# EAGLE design Soap (EAGLE 7.1.0)

## Sheet 1 of 2
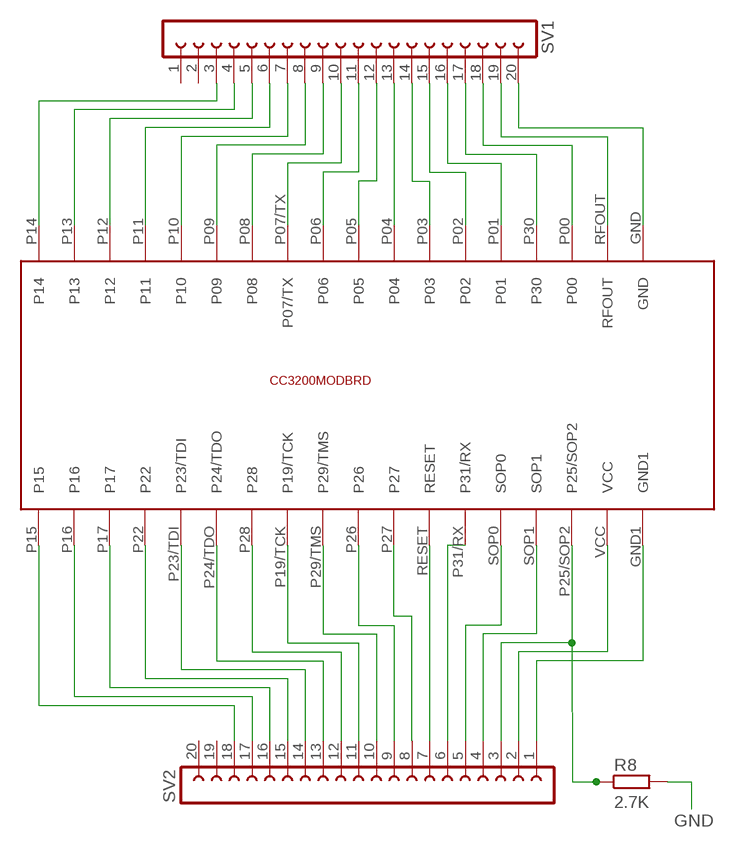
[diagram p0: schematic, sheet 1]

### Parts
R8  2.7K  RESISTOR  [R0603]
SV1  FE20-1  [FE20]
SV2  FE20-1  [FE20]
U$1  CC3200MOD  [CC3200MOD]

### Nets
+3V3: SV2.2 U$1.VCC
GND [vcc]: R8.2 SV1.20 SV2.1 U$1.GND U$1.GND1 ; also sheet 2
N$4: SV2.18 U$1.P15
N$6: SV2.17 U$1.P16
N$7: SV2.16 U$1.P17
N$8: SV2.15 U$1.P22
N$9: SV2.14 U$1.P23/TDI
N$10: SV2.13 U$1.P24/TDO
N$11: SV2.12 U$1.P28
N$12: SV2.11 U$1.P19/TCK
N$13: SV2.10
N$14: SV1.3 U$1.P14
N$15: SV1.4 U$1.P13
N$16: SV1.5 U$1.P12
N$17: SV1.6 U$1.P11
N$18: SV1.7 U$1.P10
N$19: SV1.8 U$1.P09
N$20: SV1.9 U$1.P08
N$21: SV1.10 U$1.P07/TX
N$22: SV1.11 U$1.P06
N$23: SV1.12 U$1.P05
N$24: SV1.13 U$1.P04
N$25: SV1.14 U$1.P03
N$26: SV1.15 U$1.P02
N$27: SV1.16 U$1.P01
N$28: SV1.17 U$1.P30
N$29: SV1.18 U$1.P00
N$30: SV1.19 U$1.RFOUT
N$32: SV2.9 U$1.P26
N$33: SV2.8 U$1.P27
N$34: SV2.7 U$1.RESET
N$35: SV2.6 U$1.P31/RX
N$36: SV2.5 U$1.SOP0
N$37: SV2.4 U$1.SOP1
SOP2: R8.1 SV2.3 U$1.P25/SOP2
Unconnected: SV1.1 SV1.2 SV2.19 SV2.20 U$1.P29/TMS

## Sheet 2 of 2
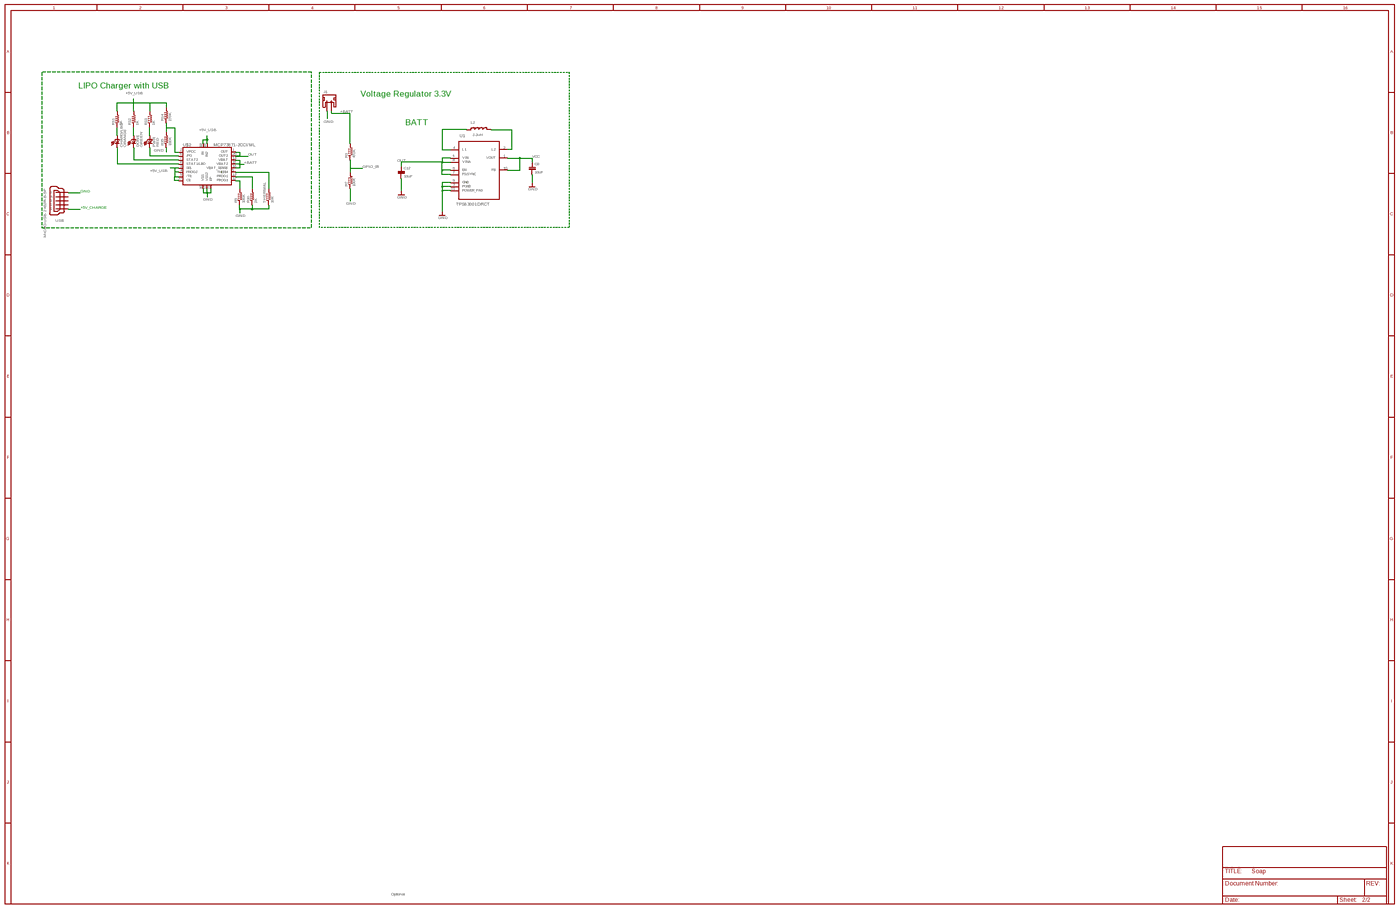
[diagram p1: schematic, sheet 2, overview]
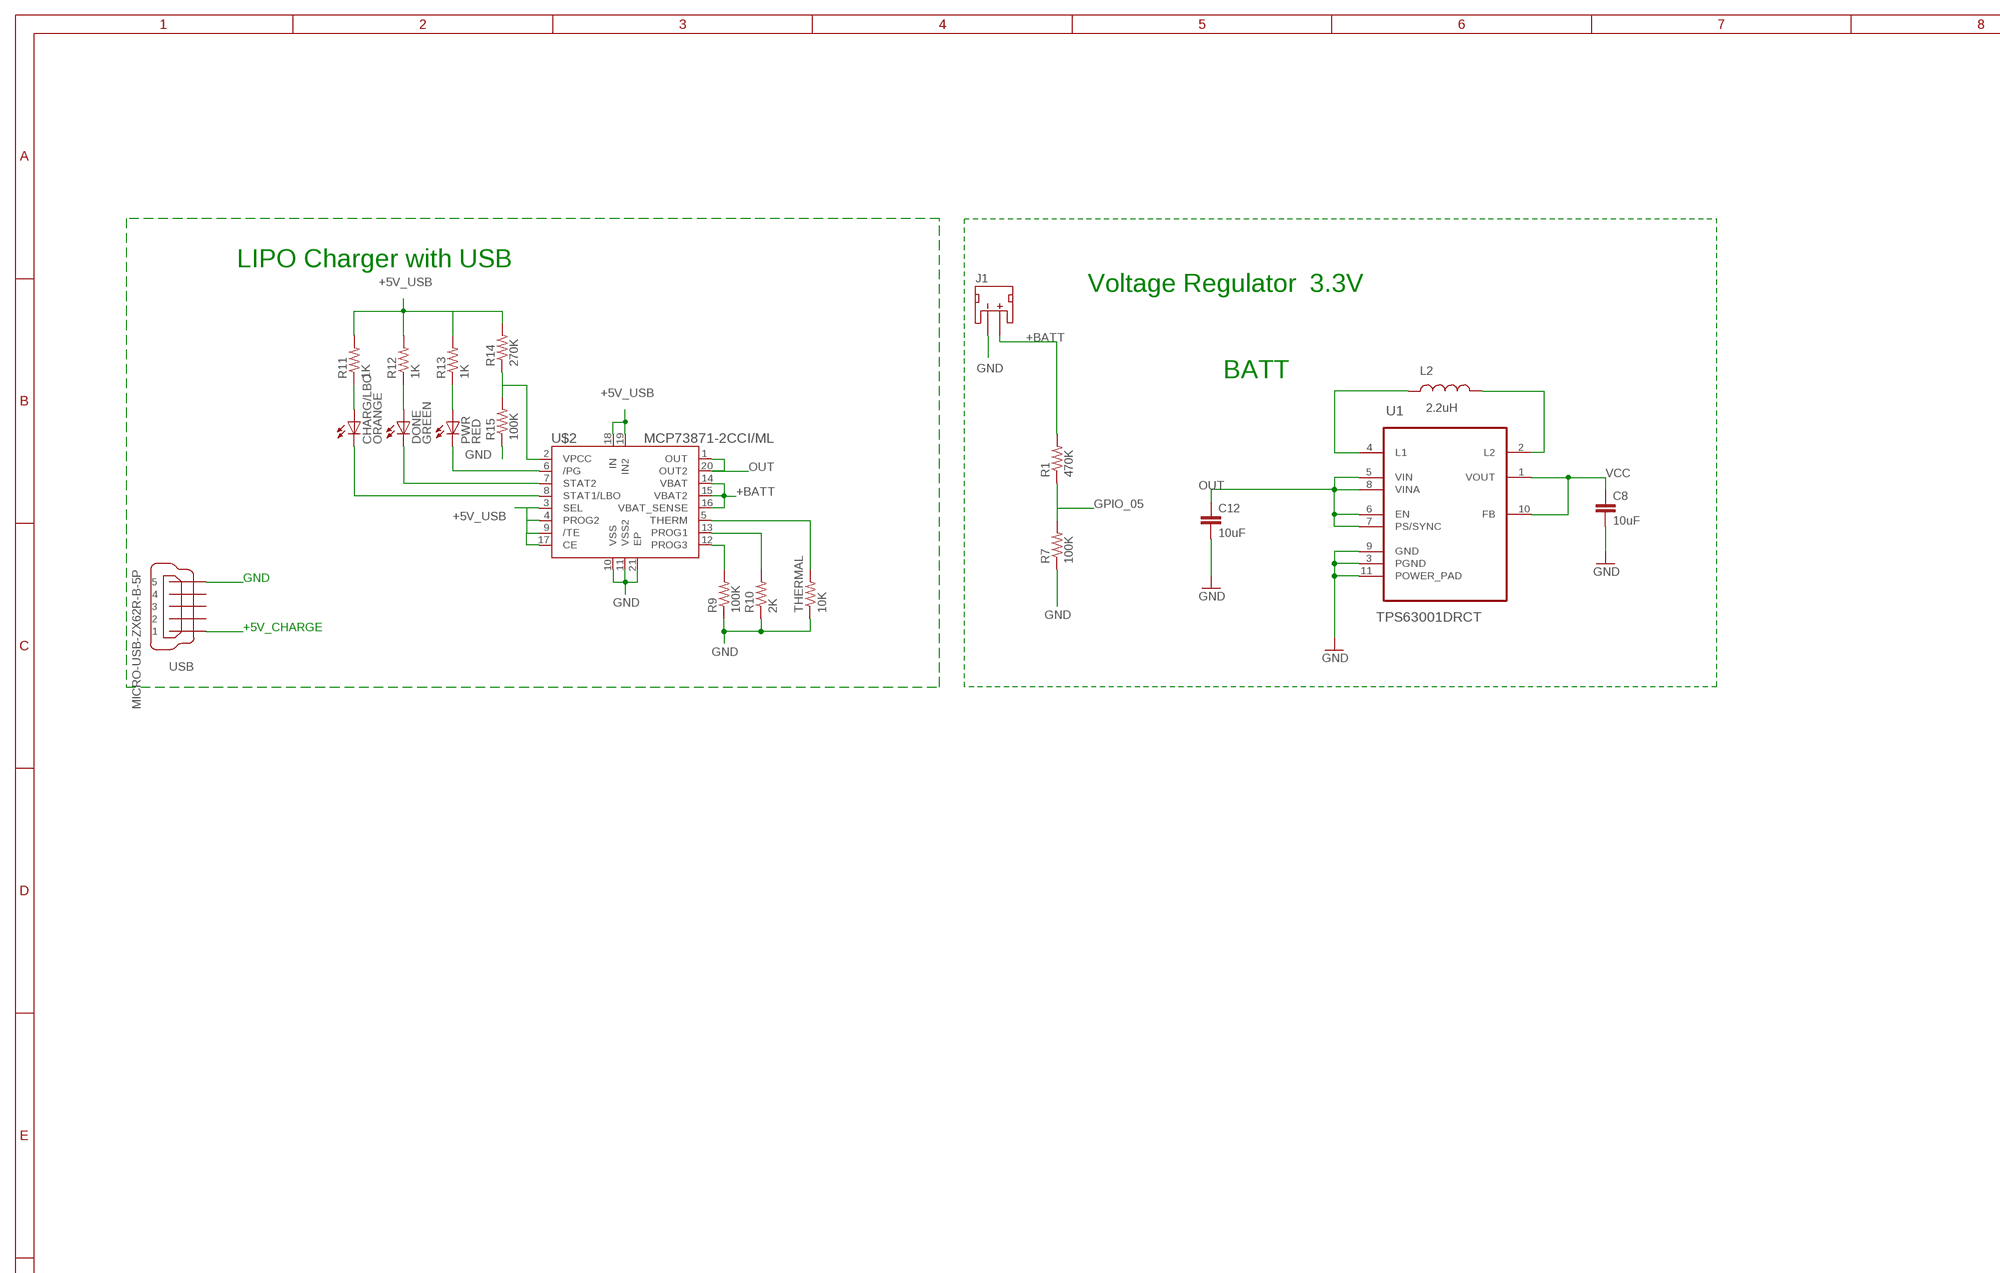
[diagram p2: schematic, sheet 2, part 1 of 4]
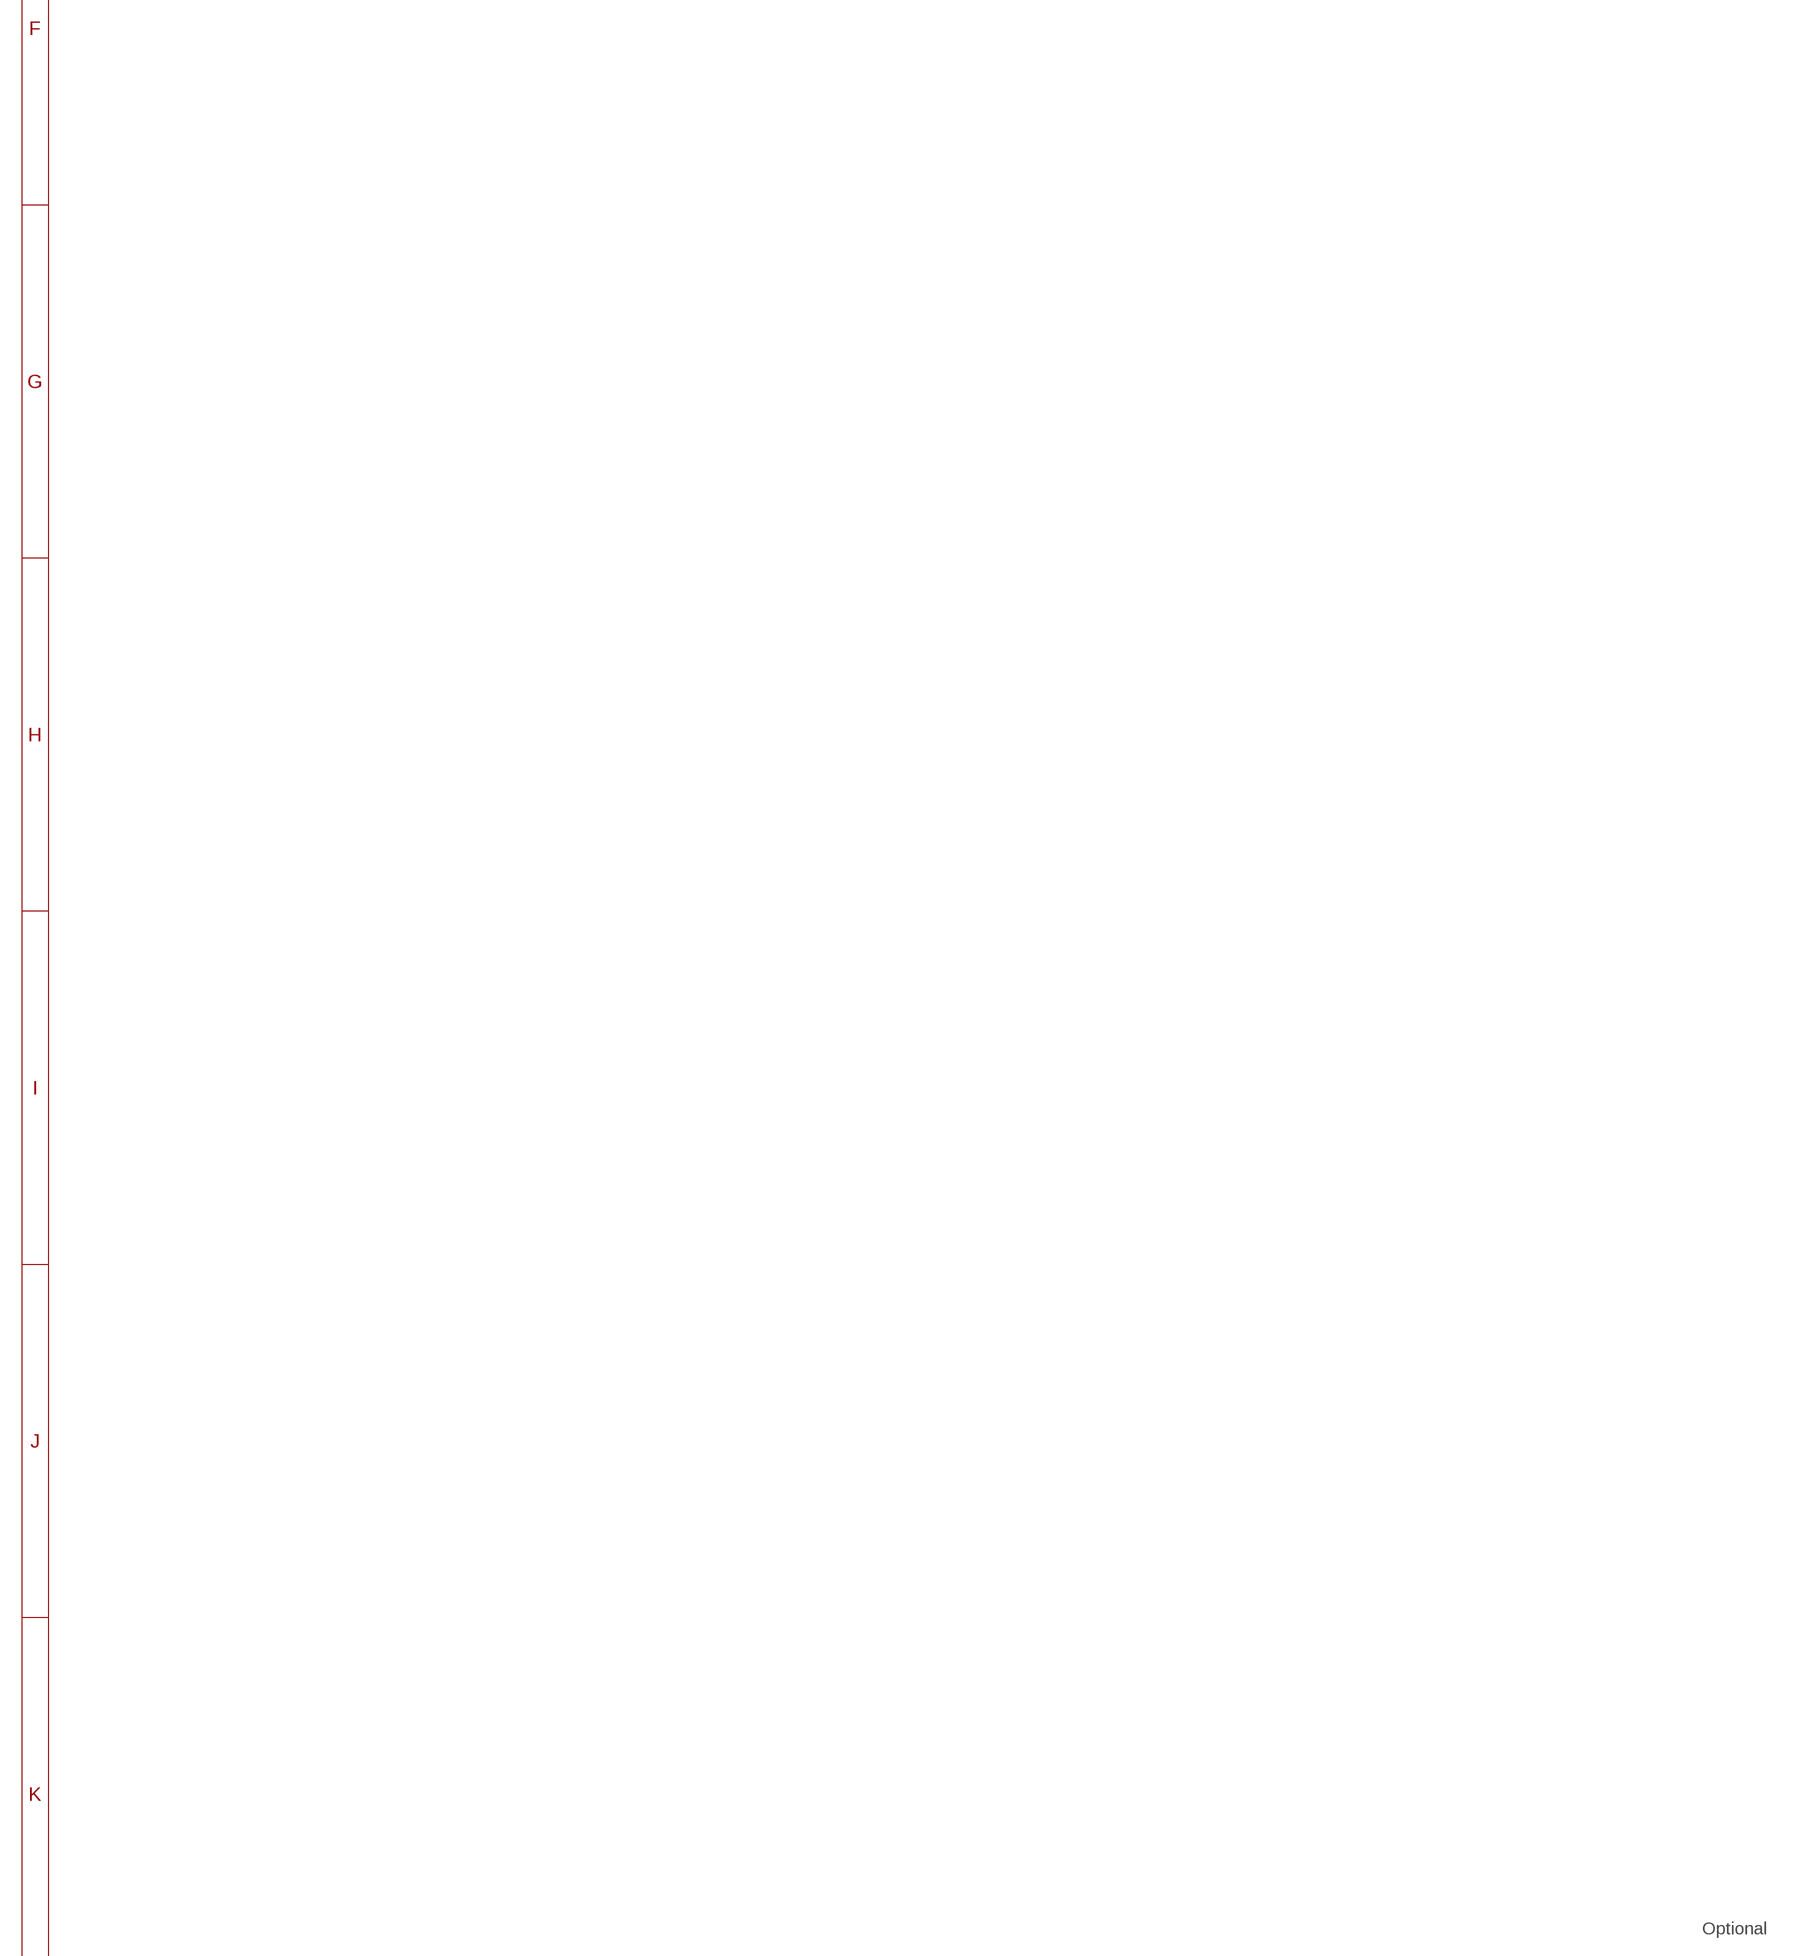
[diagram p3: schematic, sheet 2, part 2 of 4]
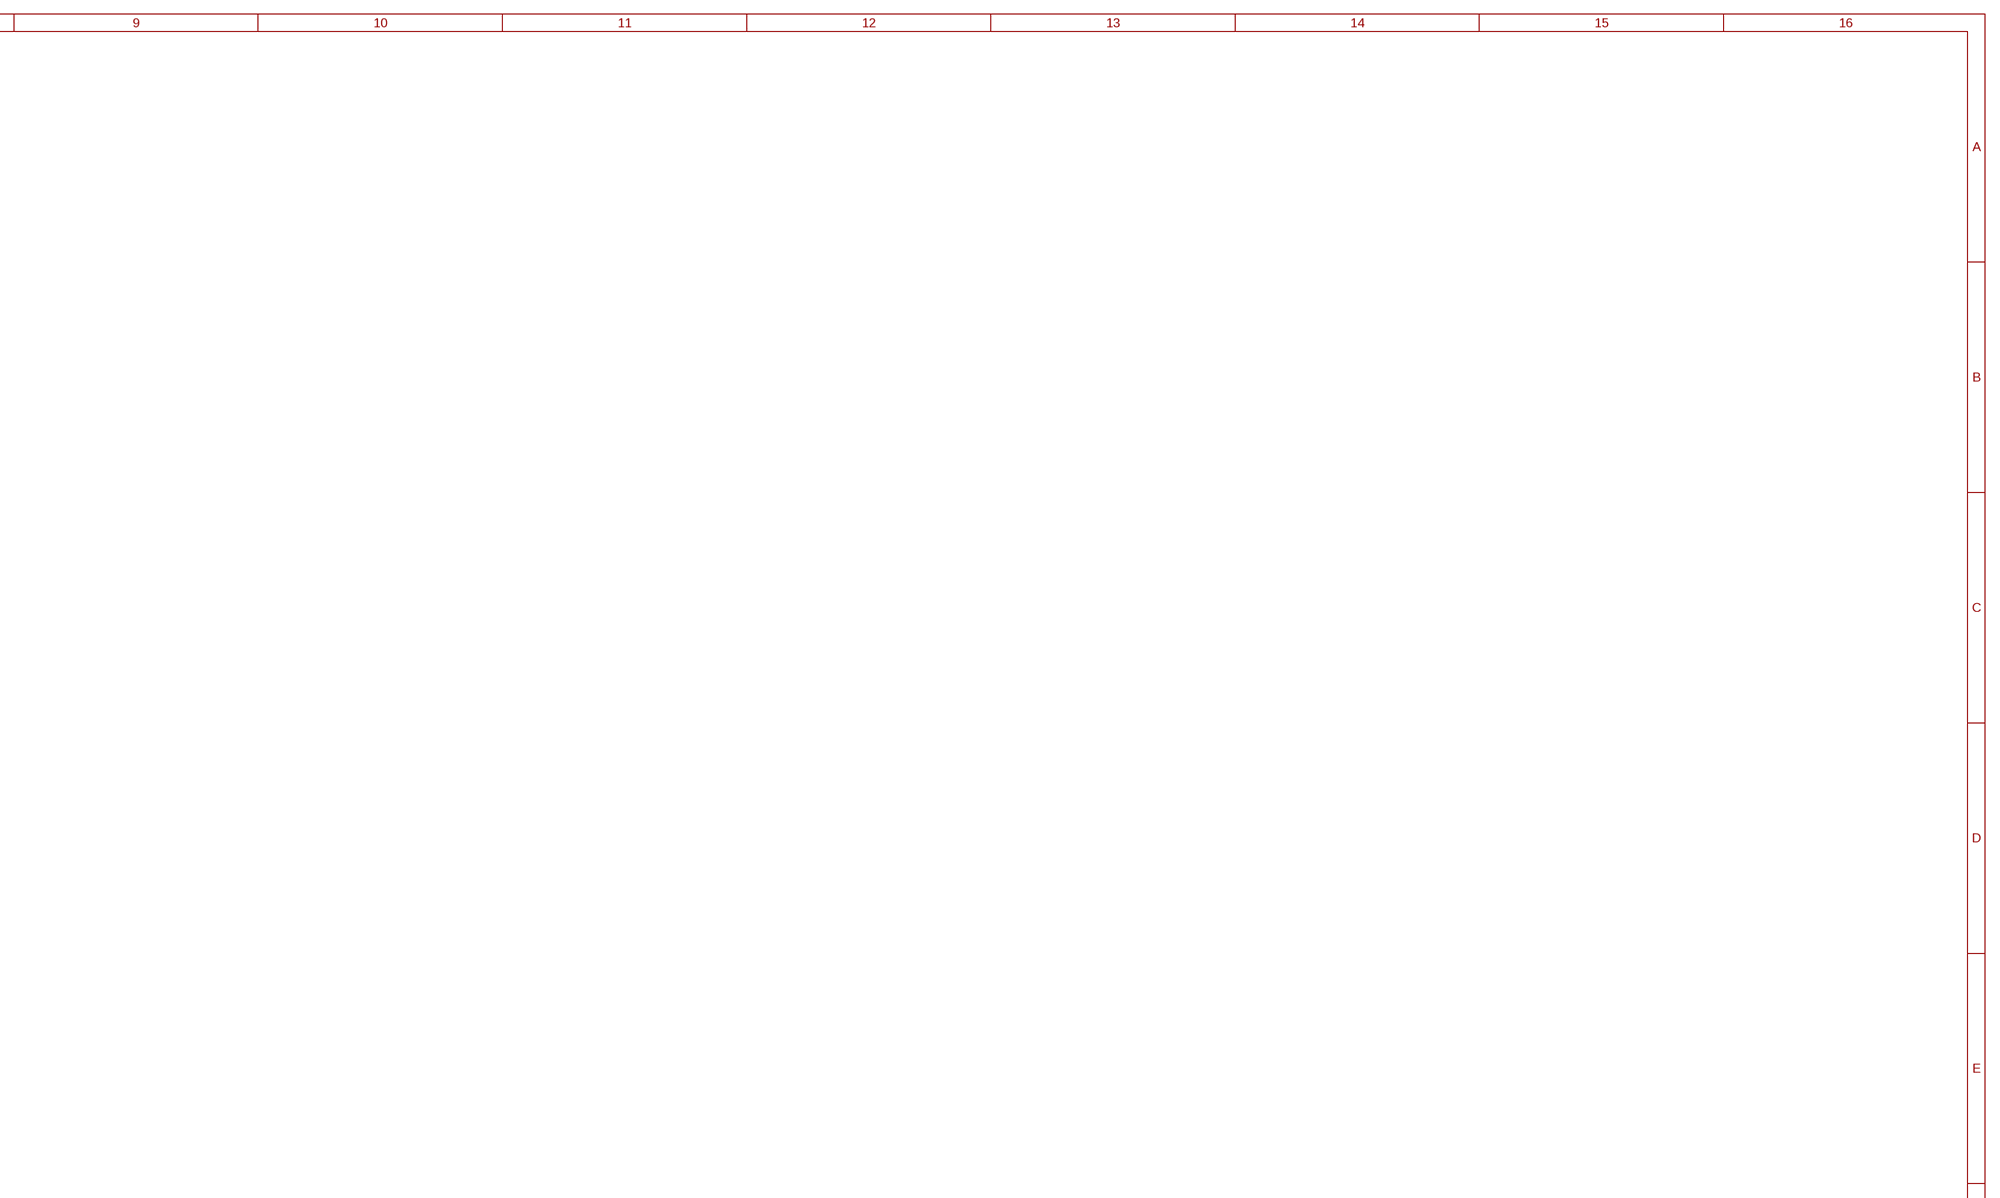
[diagram p4: schematic, sheet 2, part 3 of 4]
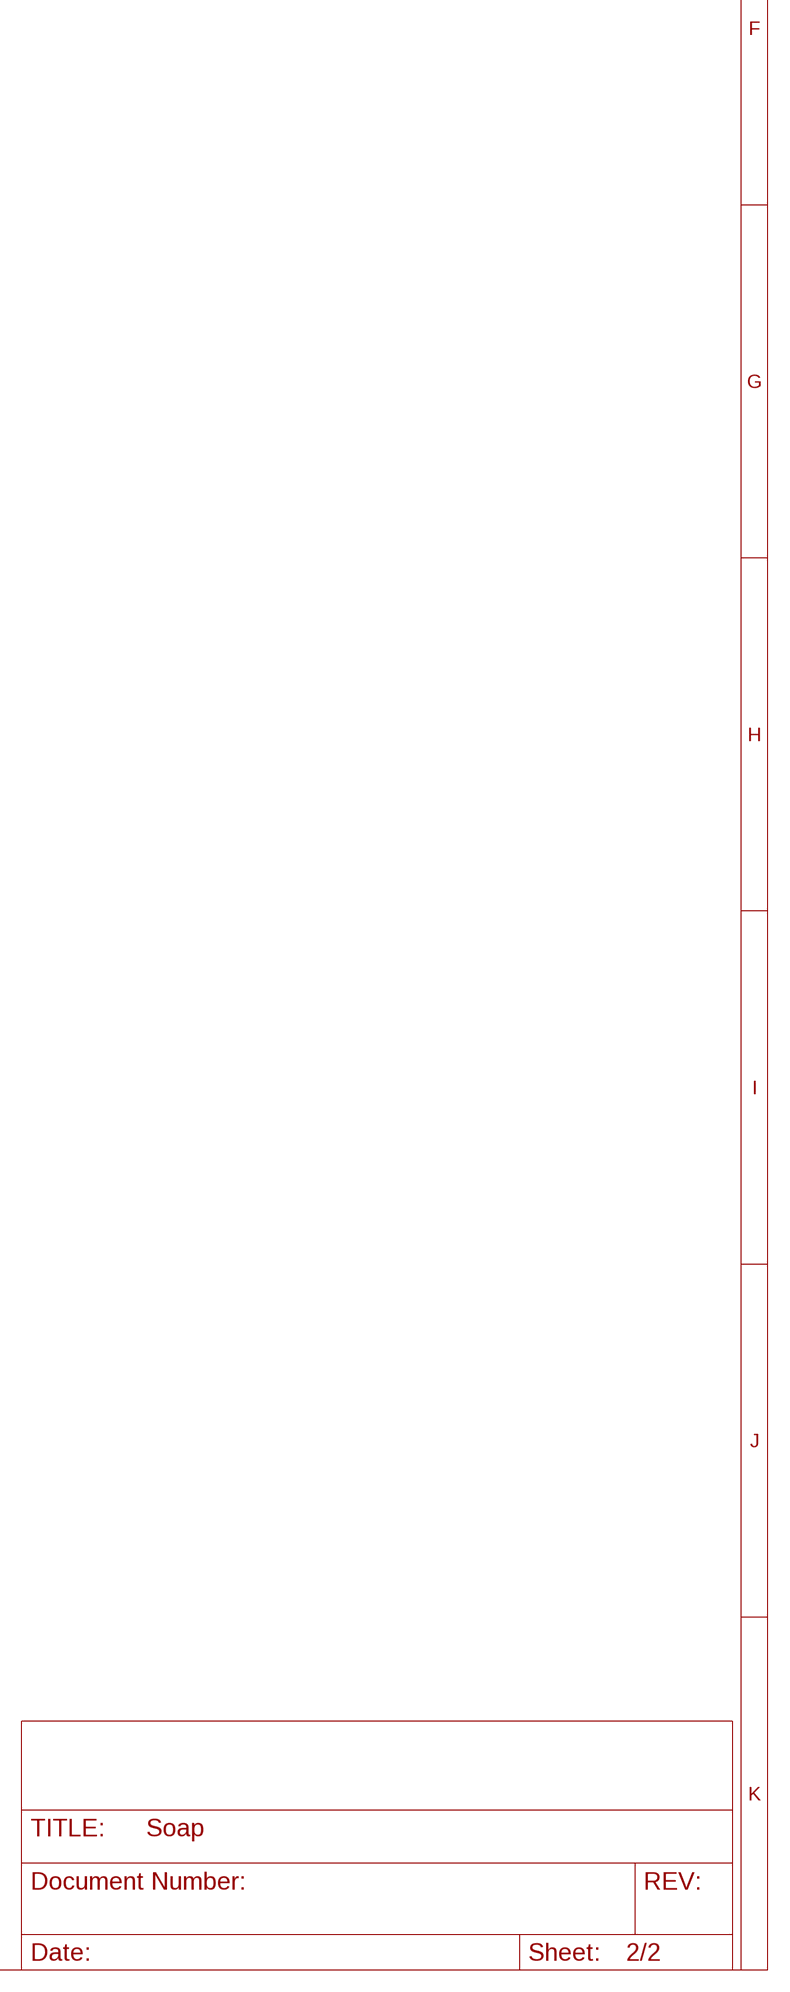
[diagram p5: schematic, sheet 2, part 4 of 4]

### Parts
C8  10uF  C-EUC0603  [C0603]
C12  10uF  C-EUC0603  [C0603]
CHARG/LBO  ORANGE  LEDSML0603  [SML0603]
DONE  GREEN  LEDSML0603  [SML0603]
J1  JST_2MM_MALE  [JST-2-SMD]
L2  2.2uH  INDUCTOR0805  [0805]
PWR  RED  LEDSML0603  [SML0603]
R1  470K  RESISTOR0603  [0603-RES]
R7  100K  RESISTOR0603  [0603-RES]
R9  100K  RESISTOR0603-RES  [0603-RES]
R10  2K  RESISTOR0603-RES  [0603-RES]
R11  1K  RESISTOR0603-RES  [0603-RES]
R12  1K  RESISTOR0603-RES  [0603-RES]
R13  1K  RESISTOR0603-RES  [0603-RES]
R14  270K  RESISTOR0603-RES  [0603-RES]
R15  100K  RESISTOR0603-RES  [0603-RES]
THERMAL  10K  RESISTOR0603-RES  [0603-RES]
U1  TPS63001DRCT  [SON50P300X300X100-11N]
U$2  MCP73871-2CCI/ML  [QFN20-4X4]
USB  MICRO-USB-ZX62R-B-5P  [ZX62R-B-5P]

### Nets
+5V_USB: R11.2 R12.2 R13.2 R14.2 U$2.3(SEL) U$2.4(PROG2) U$2.9(/TE) U$2.17(CE) U$2.18(IN) U$2.19(IN2) USB.1
+BATT: J1.2(+) R1.2 U$2.14(VBAT) U$2.15(VBAT2) U$2.16(VBAT_SENSE)
GND [vcc]: C8.2 C12.2 J1.1(-) R7.1 R9.1 R10.1 R15.1 THERMAL.1 U1.3(PGND) U1.9(GND) U1.11(POWER_PAD) U$2.10(VSS) U$2.11(VSS2) U$2.21(EP) USB.5 ; also sheet 1
GPIO_05: R1.1 R7.2
N$1: CHARG/LBO.A R11.1
N$2: DONE.A R12.1
N$3: PWR.A R13.1
N$52: L2.1 U1.4(L1)
N$53: L2.2 U1.2(L2)
N$55: R9.2 U$2.12(PROG3)
N$56: R10.2 U$2.13(PROG1)
N$57: PWR.C U$2.6(/PG)
N$58: DONE.C U$2.7(STAT2)
N$59: CHARG/LBO.C U$2.8(STAT1/LBO)
N$63: R14.1 R15.2 U$2.2(VPCC)
N$64: THERMAL.2 U$2.5(THERM)
OUT: C12.1 U1.5(VIN) U1.6(EN) U1.7(PS/SYNC) U1.8(VINA) U$2.1(OUT) U$2.20(OUT2)
VCC: C8.1 U1.1(VOUT) U1.10(FB)
Unconnected: J1.NC1(PAD1) J1.NC2(PAD2) USB.2 USB.3 USB.4

### Notes on the sheet
- LIPO Charger with USB
- Voltage Regulator | 3.3V
- BATT
- GND
- +5V_CHARGE
- Optional

## Library data of the parts
C8 C12 = rcl:C-EU: CAPACITOR, European symbol
CHARG/LBO DONE PWR = led:LED: LED OSRAM: - CHIPLED LG R971, LG N971, LY N971, LG Q971, LY Q971, LO R971, LY R971 LH N974, LH R974 LS Q976, LO Q976, LY Q976 LO Q996 - Hyper CHIPLED LW Q18S LB Q993, LB Q99A, LB R99A - SideLED LS A670, LO A670, LY A670, LG A670, LP A670 LB A673, LV A673, LT A673, LW A673 LH A674 LY A675 LS A676, LA A676, LO A676, LY A676, LW A676 LS A679, LY A679, LG A679 - Hyper Micro SIDELED® LS Y876, LA Y876, LO Y876, LY Y876 LT Y87S - SmartLED LW L88C, LW L88S LB L89C, LB L89S, LG L890 LS L89K, LO L89K, LY L89K LS L896, LA L896, LO L896, LY L896 - TOPLED LS T670, LO T670, LY T670, LG T670, LP T670 LSG T670, LSP T670, LSY T670, LOP T670, LYG T670 LG T671, LOG T671, LSG T671 LB T673, LV T673, LT T673, LW T673 LH T674 LS T676, LA T676, LO T676, LY T676, LB T676, LH T676, LSB T676, LW T676 LB T67C, LV T67C, LT T67C, LS T67K, LO T67K, LY T67K, LW E67C LS E67B, LA E67B, LO E67B, LY E67B, LB E67C, LV E67C, LT E67C LW T67C LS T679, LY T679, LG T679 LS T770, LO T770, LY T770, LG T770, LP T770 LB T773, LV T773, LT T773, LW T773 LH T774 LS E675, LA E675, LY E675, LS T675 LS T776, LA T776, LO T776, LY T776, LB T776 LHGB T686 LT T68C, LB T68C - Hyper Mini TOPLED® LB M676 - Mini TOPLED Santana® LG M470 LS M47K, LO M47K, LY M47K Source: http://www.osram.convergy.de LUXEON: - LUMILED® LXK2-PW12-R00, LXK2-PW12-S00, LXK2-PW14-U00, LXK2-PW14-V00 LXK2-PM12-R00, LXK2-PM12-S00, LXK2-PM14-U00 LXK2-PE12-Q00, LXK2-PE12-R00, LXK2-PE12-S00, LXK2-PE14-T00, LXK2-PE14-U00 LXK2-PB12-K00, LXK2-PB12-L00, LXK2-PB12-M00, LXK2-PB14-N00, LXK2-PB14-P00, LXK2-PB14-Q00 LXK2-PR12-L00, LXK2-PR12-M00, LXK2-PR14-Q00, LXK2-PR14-R00 LXK2-PD12-Q00, LXK2-PD12-R00, LXK2-PD12-S00 LXK2-PH12-R00, LXK2-PH12-S00 LXK2-PL12-P00, LXK2-PL12-Q00, LXK2-PL12-R00 Source: www.luxeon.com KINGBRIGHT: KA-3528ASYC Source: www.kingbright.com
J1 = SparkFun-Connectors:JST_2MM_MALE: Mates to single-cell LiPo batteries. CONN-08352; PROD_ID: CONN-08352
L2 = SparkFun-Passives:INDUCTOR: Inductors Basic Inductor/Choke - 0603 and 1206. Footprints are not proven and vary greatly between part numbers. SRN6045- 33uH, 20% 1.4A SDR0403-560KL - 56uH, 10%, 500mA RMS/740mA peak
R1 R7 = SparkFun-Resistors:RESISTOR: Resistor Basic schematic elements and footprints for 0603, 1206, and PTH resistors.
R8 = BaseApp:RESISTOR: Resistance Package :- 0603 Mount :-Surface mount
R9-R15 THERMAL = SparkFun-Passives:RESISTOR: Resistor Basic schematic elements and footprints for 0603, 1206, and PTH resistors.
SV1 SV2 = con-lsta:FE20-1: FEMALE HEADER; OC_FARNELL: unknown; OC_NEWARK: unknown
U1 = TPS63001:TPS63001DRCT: HIGH EFFICIENT SINGLE INDUCTOR BUCK-BOOST CONVERTER WITH 1.8-A SWITCHES; MPN: TPS63001DRCT; OC_FARNELL: 1652399; OC_NEWARK: 22M1824; PACKAGE: SON-10; SUPPLIER: TEXAS INSTRUMENTS
U$1 = CC3200MODBRD:CC3200MOD
U$2 = microchip-battery:MCP73871: Stand-Alone System Load Sharing and Li-Ion / Li-Polymer Battery Charge Managemen The MCP73871 device is a 1A fully integrated linear solution for system load sharing and Li-Ion / Li-Polymer battery charge management with AC-DC wall adapter and USB port power sources selection. It?s also capable of autonomous power source selection between input or battery. The MCP73871 device employs a constant current/constant voltage (CC/CV) charge algorithm with selectable charge termination point. The constant voltage regulation is fixed with four available options: 4.10V, 4.20V, 4.35V, or 4.40V.; LBO: 3.1 V; SAFETYTIMER: 6 Hours; VREG: 4.20V
USB = con-hirose:MICRO-USB-: Hirose Micro USB Connector ZX62R-B-5P: Micro B, reverse (top mount) shell SMT Supplier: DigiKey H11574CT-ND Source: http://www.hirose.co.jp/cataloge_hp/e24200011.pdf

## Net classes
2 RF: width 0.381 mm, clearance 0.381 mm

## Board
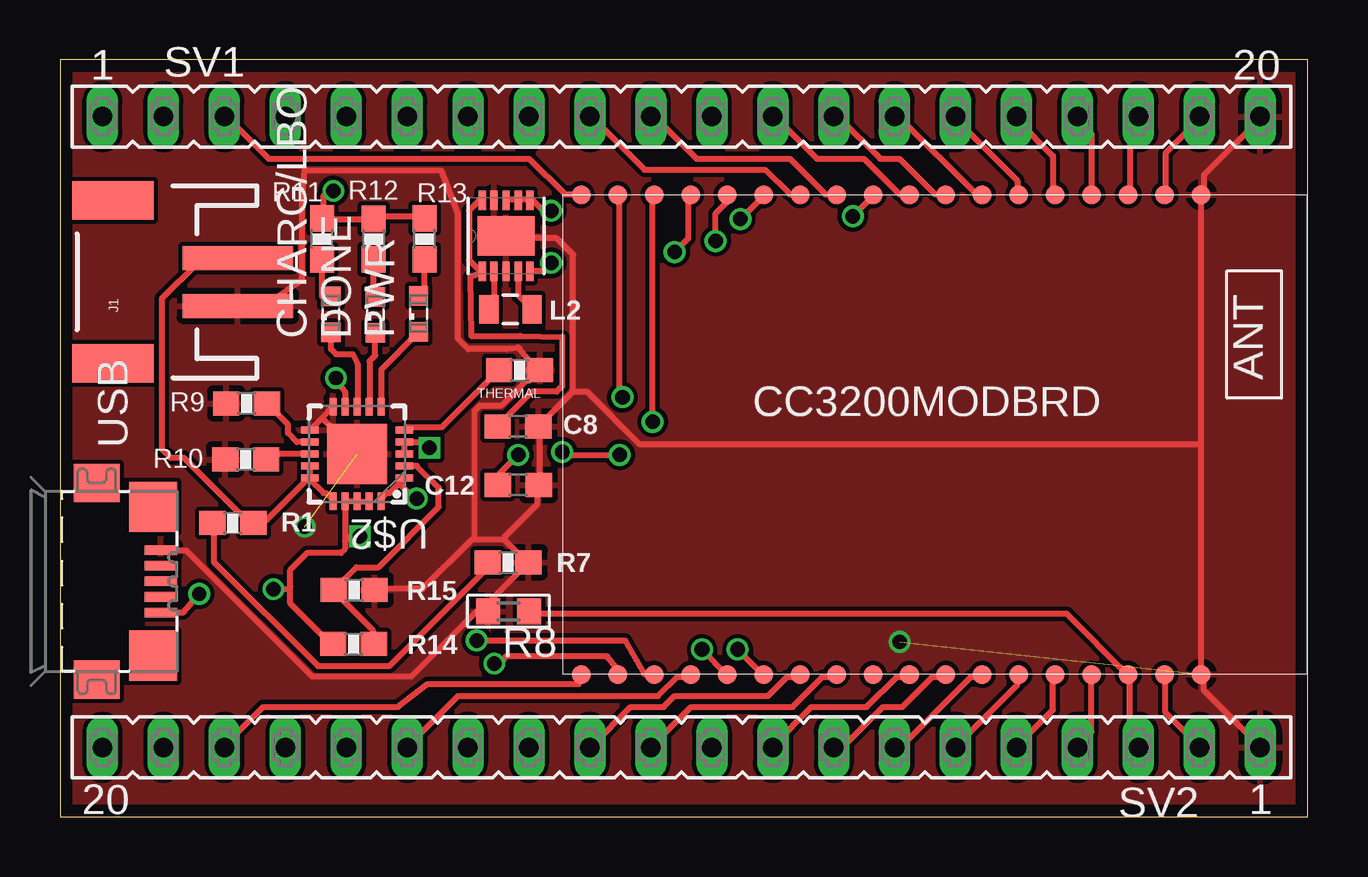
[diagram p6: board, top side]
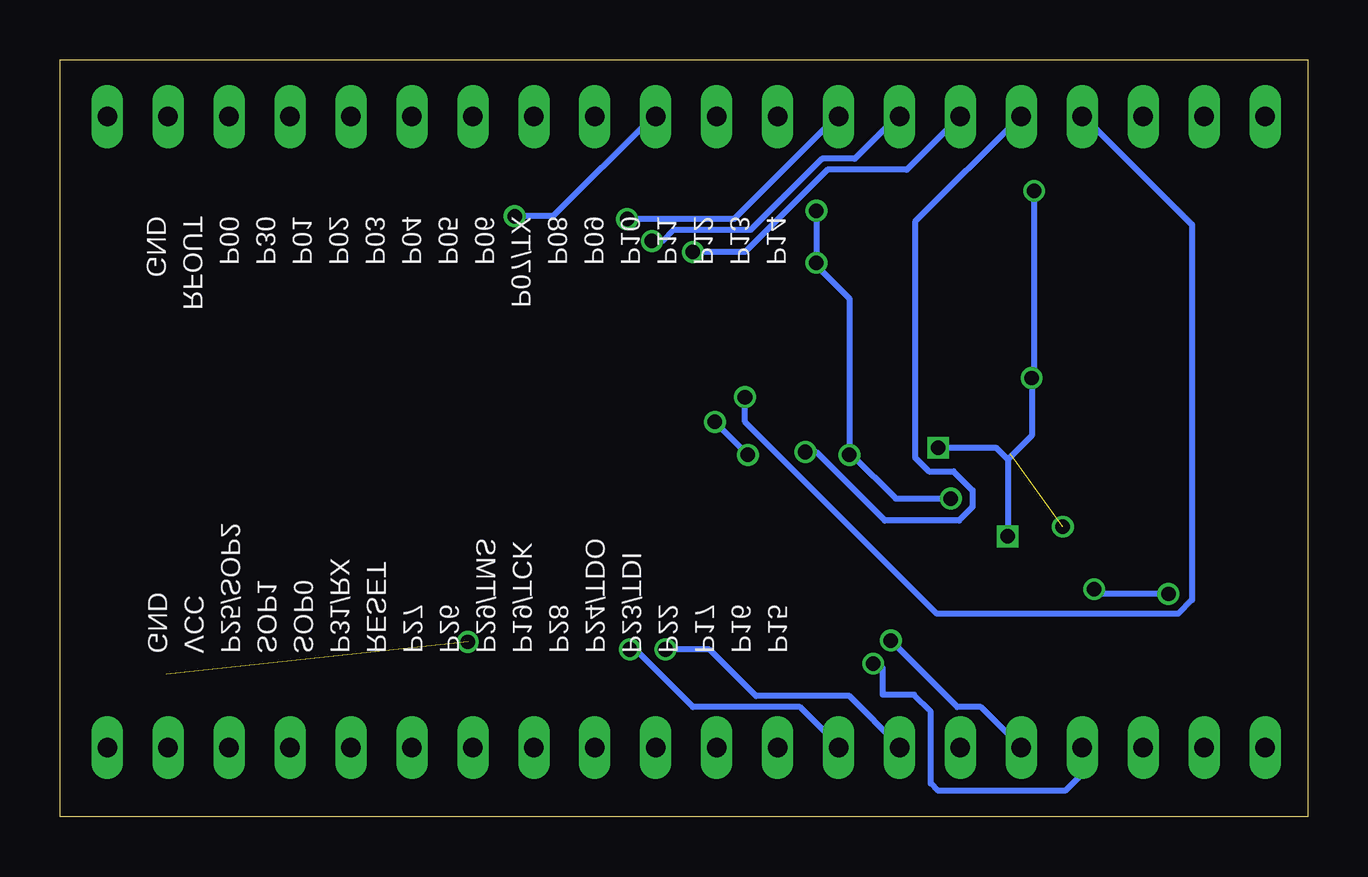
[diagram p7: board, bottom side, seen from below]

Size 52 x 31.56 mm. Coordinates in mm from the lower left corner, seen from the top.
Outline: 0,0 52,0 52,31.56 0,31.56 0,0
Copper layers (1*16): Top 0.035mm / dielectric 1.5mm / Bottom 0.035mm
Design rules "SmartEagleRules": minimum track width 7mil, minimum drill 12mil, track to track 7mil, track to pad 7mil, pad to pad 7mil, via to via 7mil, smd to smd 0mil, copper to edge 20mil, drill to drill 10mil, minimum pad ring 10mil, minimum via ring 6mil, stop-mask expansion 2mil, vias tented up to drill 25mil, thermal gap 10mil

### Footprints (pad centres in the part's own frame; a part is rotated, then mirrored left to right if it is on the bottom)
C0603 = smd 1.1 x 1: 1 -0.85,0; 2 0.85,0
SML0603 = smd 0.8 x 0.8: A 0.75,0; C -0.75,0
JST-2-SMD = smd 1 x 4.6: 1 -1,-3.7; 2 1,-3.7 | smd 1.6 x 3.4: NC1 -3.4,1.5; NC2 3.4,1.5
0805 = smd 0.8 x 1.2: 1 -0.9,0; 2 0.9,0
0603-RES = smd 1.1 x 1: 1 -0.85,0; 2 0.85,0
R0603 = smd 1 x 1.1: 1 -0.85,0; 2 0.85,0
FE20 = drill 0.813 long: 1 -24.13,0; 2 -21.59,0; 3 -19.05,0; 4 -16.51,0; 5 -13.97,0; 6 -11.43,0; 7 -8.89,0; 8 -6.35,0; 9 -3.81,0; 10 -1.27,0; 11 1.27,0; 12 3.81,0; 13 6.35,0; 14 8.89,0; 15 11.43,0; 16 13.97,0; 17 16.51,0; 18 19.05,0; 19 21.59,0; 20 24.13,0
SON50P300X300X100-11N = smd 0.813 x 0.305: 1 -1.473,0.991; 2 -1.473,0.508; 3 -1.473,0; 4 -1.473,-0.508; 5 -1.473,-0.991; 6 1.473,-0.991; 7 1.473,-0.508; 8 1.473,0; 9 1.473,0.508; 10 1.473,0.991 | smd 1.651 x 2.388: 11 0,0
CC3200MOD = smd 0.8 x 0.8: GND 11.09,10; GND1 11.09,-10; P00 8.05,10; P01 5.01,10; P02 3.49,10; P03 1.97,10; P04 0.45,10; P05 -1.07,10; P06 -2.59,10; P07/TX -4.11,10; P08 -5.63,10; P09 -7.15,10; P10 -8.67,10; P11 -10.19,10; P12 -11.71,10; P13 -13.23,10; P14 -14.75,10; P15 -14.75,-10; P16 -13.23,-10; P17 -11.71,-10; P19/TCK -4.11,-10; P22 -10.19,-10; P23/TDI -8.67,-10; P24/TDO -7.15,-10; P25/SOP2 8.05,-10; P26 -1.07,-10; P27 0.45,-10; P28 -5.63,-10; P29/TMS -2.59,-10; P30 6.53,10; P31/RX 3.49,-10; RESET 1.97,-10; RFOUT 9.57,10; SOP0 5.01,-10; SOP1 6.53,-10; VCC 9.57,-10
QFN20-4X4 = smd 0.73 x 0.3: 1 -1.965,1; 2 -1.965,0.5; 3 -1.965,0; 4 -1.965,-0.5; 5 -1.965,-1; 11 1.965,-1; 12 1.965,-0.5; 13 1.965,0; 14 1.965,0.5; 15 1.965,1 | smd 0.3 x 0.73: 6 -1,-1.965; 7 -0.5,-1.965; 8 0,-1.965; 9 0.5,-1.965; 10 1,-1.965; 16 1,1.965; 17 0.5,1.965; 18 0,1.965; 19 -0.5,1.965; 20 -1,1.965 | smd 2.5 x 2.5: 21 0,0
ZX62R-B-5P = smd 1.35 x 0.4: 1 2.675,-1.3; 2 2.675,-0.65; 3 2.675,0; 4 2.675,0.65; 5 2.675,1.3 | smd 1.9 x 1.6: M1 0,-4.1; M2 0,4.1 | smd 2 x 2.1: M3 2.35,3.1; M4 2.35,-3.1

### Placement (x,y rotation side)
C8  19.09,16.29 0 top
C12  19.1,13.84 0 top
CHARG/LBO  11.29,20.96 90 top
DONE  13.14,20.94 90 top
J1  3.71,22.31 90 top
L2  18.78,21.17 180 top
PWR  14.94,20.98 90 top
R1  7.21,12.25 0 top
R7  18.68,10.62 180 top
R8  18.7,8.57 180 top
R9  7.78,17.24 0 top
R10  7.74,14.91 0 top
R11  10.92,24.1 90 top
R12  13.08,24.09 90 top
R13  15.2,24.1 90 top
R14  12.24,7.21 180 top
R15  12.27,9.47 180 top
SV1  25.9,29.2 0 top
SV2  25.9,2.9 180 top
THERMAL  19.15,18.63 180 top
U1  18.59,24.23 90 top
U$1  36.48,15.94 0 top
U$2  12.38,15.13 180 top
USB  1.53,9.82 0 top

### Tracks (layer width: path | path; a pad name or v marks a point on that pad's centre or on a via)
+3V3
  Top 0.254: U$1.VCC 46.08,5.84 46.08,4.36 47.45,2.99 SV2.2
+5V_USB  (via drill 0.6)
  Top 0.254: U$2.19 12.82,13.16 12.47,13.16 U$2.18 12.36,13.16 11.9,13.16 U$2.17 11.88,11.5 | U$2.9 11.9,17.16 11.9,17.7 v11.5,18.3 | 13.04,24.93 R12.2 | 10.99,24.93 R11.2 | R13.2 15.1,25.05 13.16,25.05 R12.2 | U$2.3 U$2.4 15.17,15.63 v15.4,15.4 | R14.2 11.29,7.21 9.6,8.9 9.6,9.6 | 9.6,9.6 9.6,10.3 10.3,11 11.7,11 11.88,11.18 11.88,11.5 | 10.99,24.93 R12.2 | v12.5,11.7 12.08,11.7 11.88,11.5 | USB.1 5.12,8.53 v5.8,9.3 | v8.9,9.5 9.5,9.5 9.6,9.6 | 10.99,24.93 10.99,25.89 v11.4,26.1
  Bottom 0.254: v15.4,15.4 13,15.4 12.5,14.9 | 12.5,14.9 v12.5,11.7 | 12.5,14.9 11.5,15.9 v11.5,18.3 11.4,18.3 v11.4,26.1 | v5.8,9.3 8.6,9.3 v8.9,9.5
+BATT
  Top 0.254: U$2.15 10.42,14.19 10.42,14.53 U$2.14 | U$2.16 11.33,13.27 11.1,13.5 10.99,13.5 10.42,14.07 U$2.15 | U$2.15 10.3,14.07 8.59,12.36 8.13,12.36 R1.2 8.02,12.36 7.79,12.36 5.16,14.99 4.59,14.99 4.24,15.33 4.24,21.62 5.73,23.1 7.1,23.1 J1.2
GND  (via drill 0.6)  (2 unrouted)
  Top 0.254: 49.96,29.16 SV1.20 49.96,29.05 47.68,26.76 47.68,25.96 U$1.GND 47.56,25.85 47.56,15.56 | SV2.1 49.96,2.99 47.68,5.27 47.68,5.84 U$1.GND1 47.56,5.96 47.56,15.56 | 10.93,16.64 11.33,17.05 U$2.10 | 10.93,16.64 10.53,16.25 U$2.11 10.3,16.13 | 10.93,16.64 12.36,15.22 U$2.21 | 7.1,21.16 J1.1 7.21,21.27 8.47,21.27 10.07,22.37 10.07,25.73 10.19,26.95 15.9,26.95 16.59,25.16 16.59,19.93 17.02,19.5 18.62,19.5 19.17,19.55 19.07,19.57 19.9,18.64 THERMAL.1 19.9,18.53 19.56,18.19 19.45,18.19 18.42,17.16 17.5,17.16 17.27,16.93 17.27,11.56 | 18.53,11.56 17.27,11.56 | 17.27,11.56 17.16,11.56 15.1,9.5 13.16,9.5 R15.1 | 18.53,11.56 19.45,10.64 R7.1 19.45,10.53 17.96,9.04 17.96,8.59 R8.2 17.73,8.59 17.39,8.59 14.64,5.84 10.53,5.84 5.27,11.1 4.01,11.1 USB.5 | 18.53,11.56 18.53,11.67 19.9,13.04 19.9,13.73 C12.2 20.02,13.85 20.02,16.25 C8.2 20.02,16.36 21.39,17.73 | 21.39,17.73 21.39,23.45 20.7,24.13 18.64,24.13 U1.11 | 47.56,15.56 24.13,15.56 21.96,17.73 21.39,17.73
  other vias: 10.2,12.1 35,7.3
  pour Top: 0,-0.1 52.1,-0.1 52.1,32.2 0,32.2
GPIO_05
  Top 0.254: R7.2 17.73,10.53 17.73,10.3 13.73,6.3 10.76,6.3 6.42,10.64 6.42,12.24 R1.1
N$1
  Top 0.254: CHARG/LBO.A 10.92,21.71 R11.1
N$2
  Top 0.254: DONE.A 13.08,21.69 R12.1
N$3
  Top 0.254: PWR.A 15.2,21.73 R13.1
N$4
  Top 0.254: U$1.P15 21.62,5.54 15.33,5.54 14.07,4.59 8.47,4.59 6.87,2.99 SV2.18
N$6  (via drill 0.6)
  Top 0.254: U$1.P16 23.25,6.15 22.8,6.7 18.6,6.7 18.4,6.4 v18.1,6.4
  Bottom 0.254: SV2.17 9.39,1.81 10.1,1.1 15.4,1.1 15.7,1.4 15.7,4.4 16.4,5.1 17.7,5.1 17.7,6.2 v18.1,6.4
N$7  (via drill 0.61)
  Top 0.254: v17.37,7.36 23.56,7.36 24.36,5.96 24.7,5.96 U$1.P17
  Bottom 0.254: v17.37,7.36 14.6,4.59 13.62,4.59 12.02,2.99 SV2.16
N$8
  Top 0.254: U$1.P22 26.19,5.84 25.73,5.84 24.93,5.04 16.59,5.04 14.53,2.99 SV2.15
N$9  (via drill 0.61)
  Top 0.254: v26.76,6.99 27.79,5.96 U$1.P23/TDI
  Bottom 0.254: v26.76,6.99 24.93,6.99 22.99,5.04 19.1,5.04 17.05,2.99 SV2.14
N$10  (via drill 0.61)
  Top 0.254: v28.25,6.99 29.27,5.96 U$1.P24/TDO
  Bottom 0.254: v28.25,6.99 28.02,6.99 25.62,4.59 21.16,4.59 19.56,2.99 SV2.13
N$11
  Top 0.254: U$1.P28 30.76,5.84 30.3,5.84 29.5,5.04 25.62,5.04 25.16,4.59 23.79,4.59 22.19,2.99 SV2.12
N$12
  Top 0.254: U$1.P19/TCK 32.36,5.84 31.79,5.84 30.53,4.59 26.3,4.59 24.7,2.99 SV2.11
N$14
  Top 0.254: 6.87,29.16 SV1.3 6.99,29.16 8.7,27.45 19.56,27.45 21.05,25.96 21.62,25.96 U$1.P14
N$15  (via drill 0.61)
  Top 0.254: v23.45,17.5 23.33,17.62 23.33,25.85 U$1.P13
  Bottom 0.254: 9.5,29.16 SV1.4 9.27,29.16 4.82,24.7 4.82,9.04 5.39,8.47 15.45,8.47 23.45,16.47 v23.45,17.5
N$16  (via drill 0.61)
  Top 0.254: 12.02,29.16 SV1.5 | v24.7,16.47 24.7,25.85 U$1.P12 | v23.33,15.1 21.05,15.1 v20.93,15.22
  Bottom 0.254: v23.33,15.1 v24.7,16.47 | v20.93,15.22 20.47,15.22 17.62,12.36 14.53,12.36 13.96,12.93 13.96,13.62 14.76,14.42 15.79,14.42 16.36,14.99 16.36,24.82 12.02,29.16 SV1.5
N$17  (via drill 0.61)
  Top 0.254: 14.53,29.16 SV1.6 | v25.62,23.56 26.19,24.13 26.19,25.85 U$1.P11
  Bottom 0.254: v25.62,23.56 23.45,23.56 20.02,26.99 16.7,26.99 14.53,29.16 SV1.6
N$18  (via drill 0.61)
  Top 0.254: v27.33,24.02 27.33,25.16 27.79,25.62 27.79,25.85 U$1.P10
  Bottom 0.254: 17.05,29.16 SV1.7 17.16,29.16 18.87,27.45 20.25,27.45 23.22,24.47 26.42,24.47 26.88,24.02 v27.33,24.02
N$19  (via drill 0.61)
  Top 0.254: v28.36,24.93 29.27,25.85 U$1.P09
  Bottom 0.254: 19.56,29.16 SV1.8 19.67,29.16 23.9,24.93 v28.36,24.93
N$20
  Top 0.254: U$1.P08 30.76,25.96 30.42,25.96 29.39,26.99 24.36,26.99 22.19,29.16 SV1.9
  Bottom 0.254: 22.19,29.16 SV1.9
N$21
  Top 0.254: 24.7,29.16 SV1.10 24.82,29.16 26.53,27.45 30.42,27.45 31.9,25.96 32.36,25.96 U$1.P07/TX
N$22  (via drill 0.61)
  Top 0.254: v33.05,25.05 33.85,25.85 U$1.P06
  Bottom 0.254: 27.22,29.16 SV1.11 27.33,29.16 31.45,25.05 v33.05,25.05
N$23
  Top 0.254: 29.73,29.16 SV1.12 29.85,29.16 31.56,27.45 33.5,27.45 34.99,25.96 35.33,25.96 U$1.P05
N$24
  Top 0.254: 32.36,29.16 SV1.13 32.48,29.16 34.19,27.45 34.99,27.45 36.48,25.96 36.82,25.96 U$1.P04
N$25
  Top 0.254: 34.88,29.16 SV1.14 34.99,29.16 38.19,25.96 38.42,25.96 U$1.P03
N$26
  Top 0.254: 37.39,29.16 SV1.15 37.39,29.05 39.91,26.53 39.91,25.96 U$1.P02
N$27
  Top 0.254: 39.91,29.16 SV1.16 39.91,29.05 41.39,27.56 41.39,25.96 U$1.P01
N$28
  Top 0.254: 42.42,29.16 SV1.17 42.42,29.05 42.99,28.48 42.99,25.96 U$1.P30
N$29
  Top 0.254: 44.59,28.82 44.93,29.16 SV1.18 44.59,28.7 44.59,25.96 U$1.P00
N$30
  Top 0.254: 47.45,29.16 SV1.19 47.45,29.05 46.08,27.68 46.08,25.96 U$1.RFOUT
N$32
  Top 0.254: U$1.P26 35.33,5.84 34.88,5.84 33.62,4.59 31.33,4.59 29.73,2.99 SV2.9
N$33
  Top 0.254: U$1.P27 36.82,5.84 36.36,5.84 35.1,4.59 34.3,4.59 32.7,2.99 32.36,2.99 SV2.8
N$34
  Top 0.254: U$1.RESET 38.42,5.84 37.96,5.84 35.1,2.99 34.88,2.99 SV2.7
N$35
  Top 0.254: U$1.P31/RX 39.91,5.84 39.91,5.5 37.39,2.99 SV2.6
N$36
  Top 0.254: U$1.SOP0 41.39,5.84 41.39,4.47 39.91,2.99 SV2.5
N$37
  Top 0.254: U$1.SOP1 42.99,5.84 42.99,3.56 42.42,2.99 SV2.4
N$52
  Top 0.254: U1.4 19.1,21.75 L2.1
N$53
  Top 0.254: U1.2 18.09,21.38 L2.2
N$55
  Top 0.254: U$2.12 9.87,15.63 9.5,16 9.5,16.37 R9.2
N$56
  Top 0.254: U$2.13 8.82,15.13 R10.2
N$57
  Top 0.254: U$2.6 13.39,17.16 13.39,18.64 14.87,20.13 14.94,20.13 PWR.C
N$58
  Top 0.254: U$2.7 12.9,17.11 12.9,19 13.14,19.24 DONE.C
N$59
  Top 0.254: U$2.8 12.4,17.11 12.4,18.9 12.2,19.3 11.5,19.3 11.29,19.51 CHARG/LBO.C
N$63
  Top 0.254: U$2.2 14.42,14.64 14.87,14.64 15.79,13.73 15.79,12.93 13.27,10.41 12.36,10.41 11.44,9.5 R15.2 11.44,9.39 13.04,7.79 13.04,7.21 R14.1
N$64
  Top 0.254: U$2.5 14.42,16.25 15.9,16.25 18.3,18.64 THERMAL.2
OUT  (via drill 0.61)
  Top 0.254: 14.13,13.9 14.3,14.07 U$2.1 | 14.13,13.9 13.73,13.5 13.62,13.5 13.39,13.27 U$2.20 | U1.8 18.64,25.73 18.99,25.73 U1.7 19.22,25.73 19.56,25.73 U1.6 19.67,25.73 20.13,25.27 v20.47,25.27 | v20.47,23.1 20.13,22.76 19.67,22.76 U1.5 | v19.1,15.1 18.3,14.3 18.3,13.85 C12.1 | 14.13,13.9 14.76,13.27 v14.87,13.27
  Bottom 0.254: v20.47,25.27 v20.47,23.1 20.47,22.99 19.1,21.62 v19.1,15.1 18.99,15.1 17.16,13.27 v14.87,13.27
SOP2
  Top 0.254: SV2.3 44.93,2.99 44.59,3.33 44.59,5.84 U$1.P25/SOP2 44.48,5.96 41.96,8.47 19.56,8.47 R8.1
VCC
  Top 0.254: U1.10 17.5,25.73 17.05,25.27 17.05,23.22 17.5,22.76 U1.1 17.5,22.65 17.1,22.5 17.14,20.06 19.19,20.06 20.93,20.02 20.93,17.96 20.7,17.73 19.67,17.73 18.3,16.36 C8.1